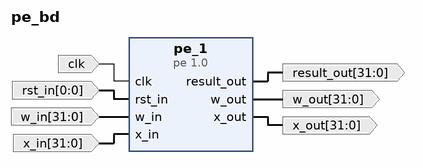
[diagram p0: block diagram of the top level]
# Vivado block design pe_bd, xczu9eg-ffvb1156-2-e, Vivado 2019.1
create_bd_design pe_bd

create_bd_port -dir I -type clk clk
create_bd_port -dir O -from 31 -to 0 -type data result_out
create_bd_port -dir I -from 0 -to 0 -type data rst_in
create_bd_port -dir I -from 31 -to 0 -type data w_in
create_bd_port -dir O -from 31 -to 0 -type data w_out
create_bd_port -dir I -from 31 -to 0 -type data x_in
create_bd_port -dir O -from 31 -to 0 -type data x_out

create_bd_cell -type ip -vlnv User_Company:SysGen:pe:1.0 pe_1

# ---- connections ----

connect_bd_net [get_bd_ports clk] [get_bd_pins pe_1/clk]
connect_bd_net [get_bd_pins pe_1/result_out] [get_bd_ports result_out]
connect_bd_net [get_bd_ports rst_in] [get_bd_pins pe_1/rst_in]
connect_bd_net [get_bd_ports w_in] [get_bd_pins pe_1/w_in]
connect_bd_net [get_bd_pins pe_1/w_out] [get_bd_ports w_out]
connect_bd_net [get_bd_ports x_in] [get_bd_pins pe_1/x_in]
connect_bd_net [get_bd_pins pe_1/x_out] [get_bd_ports x_out]

validate_bd_design
save_bd_design
